# EAGLE design Pulleyboard (EAGLE 9.6.2)
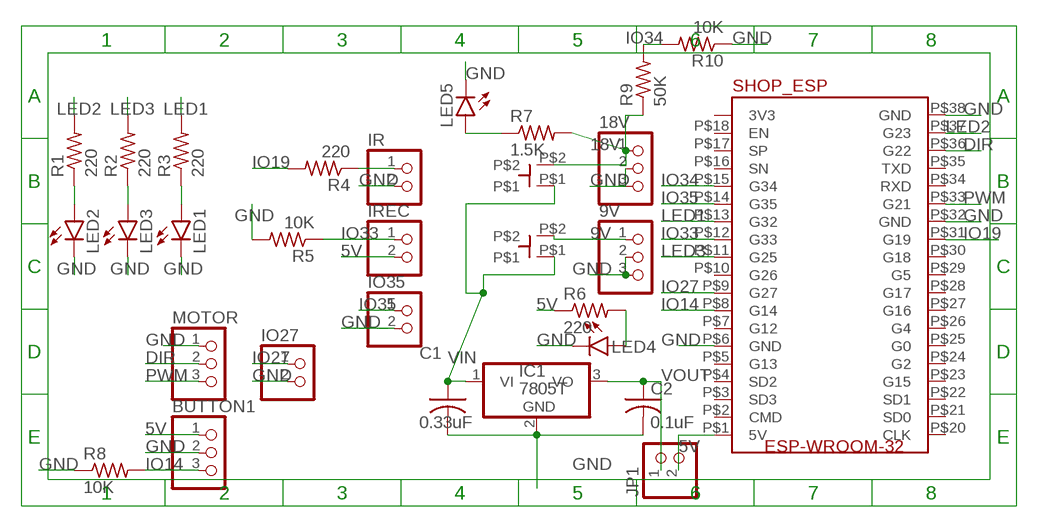
[diagram p0: schematic, sheet 1]

## Parts
9V  PINHD-1X3  [1X03]
9VSW  SWITCH  [SWTICH]
18V  PINHD-1X3  [1X03]
18VSW  SWITCH  [SWTICH]
BUTTON1  PINHD-1X3  [1X03]
C1  0.33uF  C-US025-030X050  [C025-030X050]
C2  0.1uF  C-US025-030X050  [C025-030X050]
IC1  7805T  [TO220H]
IO27  PINHD-1X2  [1X02]
IO35  PINHD-1X2  [1X02]
IR  PINHD-1X2  [1X02]
IREC  PINHD-1X2  [1X02]
JP1  PINHD-1X2  [1X02]
LED1  LED5MM  [LED5MM]
LED2  LED5MM  [LED5MM]
LED3  LED5MM  [LED5MM]
LED4  LEDCHIPLED_1206  [CHIPLED_1206]
LED5  LED5MM  [LED5MM]
MOTOR  PINHD-1X3  [1X03]
R1  220  R-US_R0805  [R0805]
R2  220  R-US_R0805  [R0805]
R3  220  R-US_R0805  [R0805]
R4  220  R-US_R0805  [R0805]
R5  10K  R-US_R0805  [R0805]
R6  220  R-US_R0805  [R0805]
R7  1.5K  R-US_R0805  [R0805]
R8  10K  R-US_R0805  [R0805]
R9  50K  R-US_R0805  [R0805]
R10  10K  R-US_R0805  [R0805]
U$3  SHOP_ESP  [ESP32-WROOM-32]

## Nets
5V: BUTTON1.1 IREC.2 JP1.2 R6.1 U$3.P$1(5V)
9V: 9V.1 9VSW.P$2
18V: 18V.1 18VSW.P$2 R7.2 R9.1
DIR: MOTOR.2 U$3.P$36(G22)
GND: 9V.2 9V.3 18V.2 18V.3 BUTTON1.2 C1.2 C2.2 IC1.2(GND) IO27.2 IO35.2 IR.2 LED1.K(C) LED2.K(C) LED3.K(C) LED4.C LED5.K(C) MOTOR.1 R5.2 R8.1 R10.1 U$3.P$6(GND) U$3.P$32(GND) U$3.P$38(GND)
IO14: BUTTON1.3 R8.2 U$3.P$8(G14)
IO19: R4.2 U$3.P$31(G19)
IO27: IO27.1 U$3.P$9(G27)
IO33: IREC.1 R5.1 U$3.P$12(G33)
IO34: R9.2 R10.2 U$3.P$15(G34)
IO35: IO35.1 U$3.P$14(G35)
LED1: R3.2 U$3.P$13(G32)
LED2: R1.2 U$3.P$37(G23)
LED3: R2.2 U$3.P$11(G25)
N$1: LED2.A R1.1
N$2: LED3.A R2.1
N$3: LED1.A R3.1
N$4: LED5.A R7.1
N$7: IR.1 R4.1
N$9: LED4.A R6.2
PWM: MOTOR.3 U$3.P$33(G21)
VIN: 9VSW.P$1 18VSW.P$1 C1.1 IC1.1(VI)
VOUT: C2.1 IC1.3(VO) JP1.1
Unconnected: U$3.P$3(SD3) U$3.P$4(SD2) U$3.P$5(G13) U$3.P$7(G12) U$3.P$10(G26) U$3.P$16(SN) U$3.P$17(SP) U$3.P$18(EN) U$3.P$20(CLK) U$3.P$21(SD0) U$3.P$22(SD1) U$3.P$23(G15) U$3.P$24(G2) U$3.P$25(G0) U$3.P$26(G4) U$3.P$27(G16) U$3.P$28(G17) U$3.P$29(G5) U$3.P$30(G18) U$3.P$34(RXD) U$3.P$35(TXD)

## Power pins joined to a net without a drawn wire
3V3: U$3.P$19(3V3)
CMD: U$3.P$2(CMD)

## Library data of the parts
9V 18V BUTTON1 MOTOR = pinhead:PINHD-1X3: PIN HEADER
9VSW = pulley:SWITCH; SPICEPREFIX: B
18VSW = pulley:SWITCH
C1 C2 = AAAMYrcl:C-US: CAPACITOR, American symbol; SPICEPREFIX: C
IC1 = linear:78*: Positive VOLTAGE REGULATOR Source: http://cache.national.com/ds/LM/LM78L05.pdf http://www.fairchildsemi.com/ds/LM/LM7805.pdf
IO27 IO35 IR IREC JP1 = pinhead:PINHD-1X2: PIN HEADER
LED1-LED3 LED5 = ledbighole:LED: LED OSRAM: - CHIPLED LG R971, LG N971, LY N971, LG Q971, LY Q971, LO R971, LY R971 LH N974, LH R974 LS Q976, LO Q976, LY Q976 LO Q996 - Hyper CHIPLED LW Q18S LB Q993, LB Q99A, LB R99A - SideLED LS A670, LO A670, LY A670, LG A670, LP A670 LB A673, LV A673, LT A673, LW A673 LH A674 LY A675 LS A676, LA A676, LO A676, LY A676, LW A676 LS A679, LY A679, LG A679 - Hyper Micro SIDELED® LS Y876, LA Y876, LO Y876, LY Y876 LT Y87S - SmartLED LW L88C, LW L88S LB L89C, LB L89S, LG L890 LS L89K, LO L89K, LY L89K LS L896, LA L896, LO L896, LY L896 - TOPLED LS T670, LO T670, LY T670, LG T670, LP T670 LSG T670, LSP T670, LSY T670, LOP T670, LYG T670 LG T671, LOG T671, LSG T671 LB T673, LV T673, LT T673, LW T673 LH T674 LS T676, LA T676, LO T676, LY T676, LB T676, LH T676, LSB T676, LW T676 LB T67C, LV T67C, LT T67C, LS T67K, LO T67K, LY T67K, LW E67C LS E67B, LA E67B, LO E67B, LY E67B, LB E67C, LV E67C, LT E67C LW T67C LS T679, LY T679, LG T679 LS T770, LO T770, LY T770, LG T770, LP T770 LB T773, LV T773, LT T773, LW T773 LH T774 LS E675, LA E675, LY E675, LS T675 LS T776, LA T776, LO T776, LY T776, LB T776 LHGB T686 LT T68C, LB T68C - Hyper Mini TOPLED® LB M676 - Mini TOPLED Santana® LG M470 LS M47K, LO M47K, LY M47K Source: http://www.osram.convergy.de LUXEON: - LUMILED® LXK2-PW12-R00, LXK2-PW12-S00, LXK2-PW14-U00, LXK2-PW14-V00 LXK2-PM12-R00, LXK2-PM12-S00, LXK2-PM14-U00 LXK2-PE12-Q00, LXK2-PE12-R00, LXK2-PE12-S00, LXK2-PE14-T00, LXK2-PE14-U00 LXK2-PB12-K00, LXK2-PB12-L00, LXK2-PB12-M00, LXK2-PB14-N00, LXK2-PB14-P00, LXK2-PB14-Q00 LXK2-PR12-L00, LXK2-PR12-M00, LXK2-PR14-Q00, LXK2-PR14-R00 LXK2-PD12-Q00, LXK2-PD12-R00, LXK2-PD12-S00 LXK2-PH12-R00, LXK2-PH12-S00 LXK2-PL12-P00, LXK2-PL12-Q00, LXK2-PL12-R00 Source: www.luxeon.com KINGBRIGHT: KA-3528ASYC Source: www.kingbright.com
LED4 = led:LED: LED OSRAM: - CHIPLED LG R971, LG N971, LY N971, LG Q971, LY Q971, LO R971, LY R971 LH N974, LH R974 LS Q976, LO Q976, LY Q976 LO Q996 - Hyper CHIPLED LW Q18S LB Q993, LB Q99A, LB R99A - SideLED LS A670, LO A670, LY A670, LG A670, LP A670 LB A673, LV A673, LT A673, LW A673 LH A674 LY A675 LS A676, LA A676, LO A676, LY A676, LW A676 LS A679, LY A679, LG A679 - Hyper Micro SIDELED® LS Y876, LA Y876, LO Y876, LY Y876 LT Y87S - SmartLED LW L88C, LW L88S LB L89C, LB L89S, LG L890 LS L89K, LO L89K, LY L89K LS L896, LA L896, LO L896, LY L896 - TOPLED LS T670, LO T670, LY T670, LG T670, LP T670 LSG T670, LSP T670, LSY T670, LOP T670, LYG T670 LG T671, LOG T671, LSG T671 LB T673, LV T673, LT T673, LW T673 LH T674 LS T676, LA T676, LO T676, LY T676, LB T676, LH T676, LSB T676, LW T676 LB T67C, LV T67C, LT T67C, LS T67K, LO T67K, LY T67K, LW E67C LS E67B, LA E67B, LO E67B, LY E67B, LB E67C, LV E67C, LT E67C LW T67C LS T679, LY T679, LG T679 LS T770, LO T770, LY T770, LG T770, LP T770 LB T773, LV T773, LT T773, LW T773 LH T774 LS E675, LA E675, LY E675, LS T675 LS T776, LA T776, LO T776, LY T776, LB T776 LHGB T686 LT T68C, LB T68C - Hyper Mini TOPLED® LB M676 - Mini TOPLED Santana® LG M470 LS M47K, LO M47K, LY M47K Source: http://www.osram.convergy.de LUXEON: - LUMILED® LXK2-PW12-R00, LXK2-PW12-S00, LXK2-PW14-U00, LXK2-PW14-V00 LXK2-PM12-R00, LXK2-PM12-S00, LXK2-PM14-U00 LXK2-PE12-Q00, LXK2-PE12-R00, LXK2-PE12-S00, LXK2-PE14-T00, LXK2-PE14-U00 LXK2-PB12-K00, LXK2-PB12-L00, LXK2-PB12-M00, LXK2-PB14-N00, LXK2-PB14-P00, LXK2-PB14-Q00 LXK2-PR12-L00, LXK2-PR12-M00, LXK2-PR14-Q00, LXK2-PR14-R00 LXK2-PD12-Q00, LXK2-PD12-R00, LXK2-PD12-S00 LXK2-PH12-R00, LXK2-PH12-S00 LXK2-PL12-P00, LXK2-PL12-Q00, LXK2-PL12-R00 Source: www.luxeon.com KINGBRIGHT: KA-3528ASYC Source: www.kingbright.com
R1-R10 = rcl:R-US_: RESISTOR, American symbol; SPICEPREFIX: R
U$3 = AAALib:SHOP_ESP

## Board
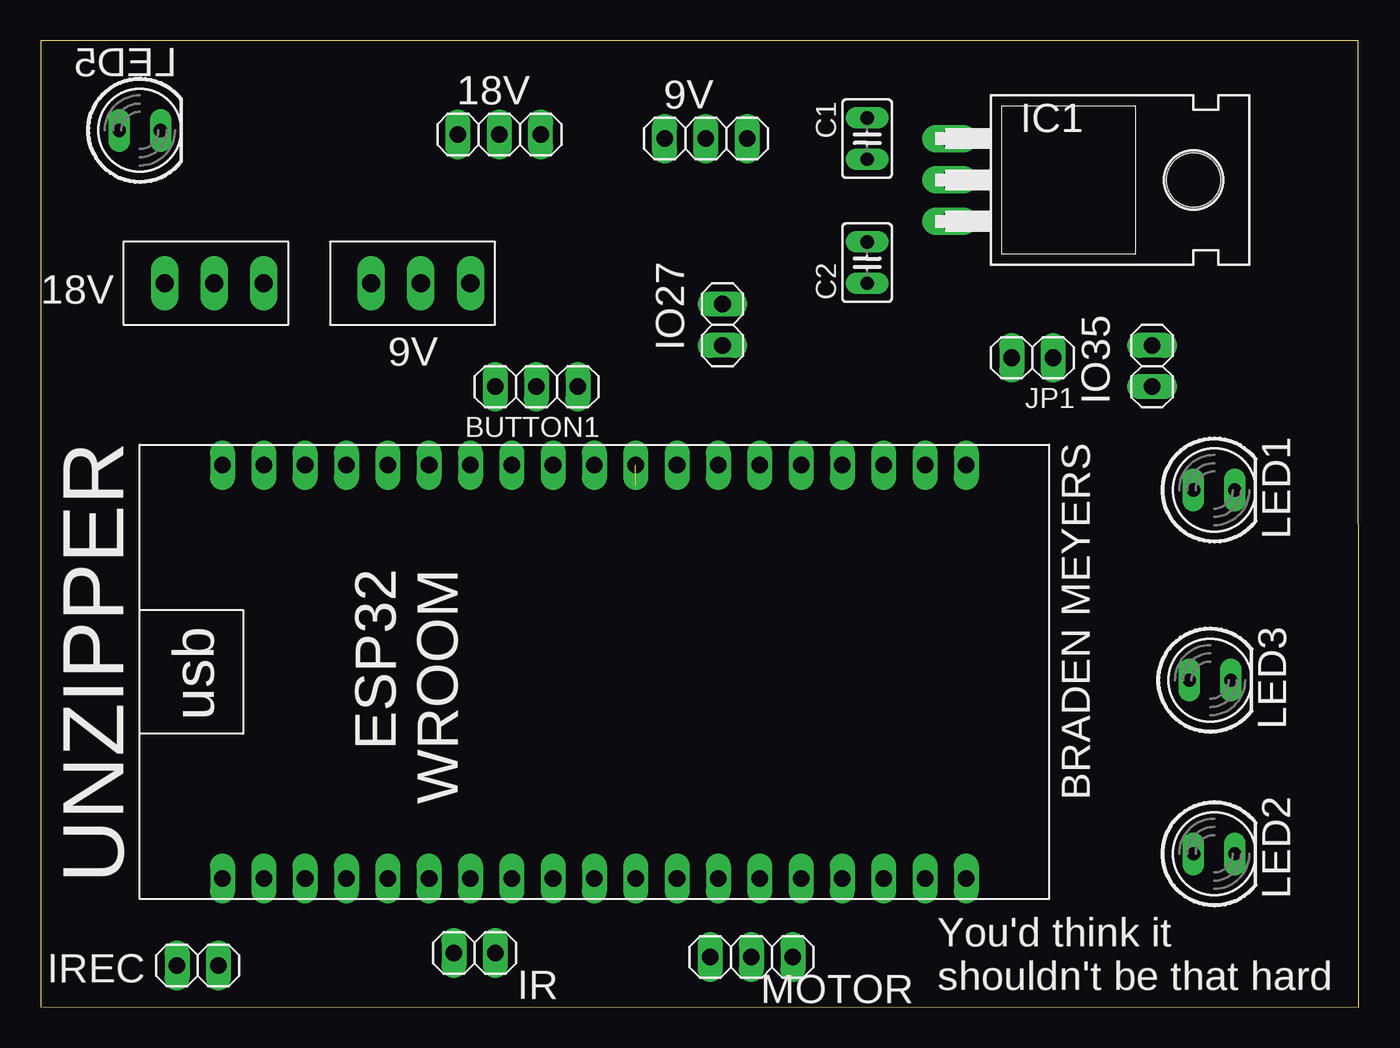
[diagram p1: board, top side]
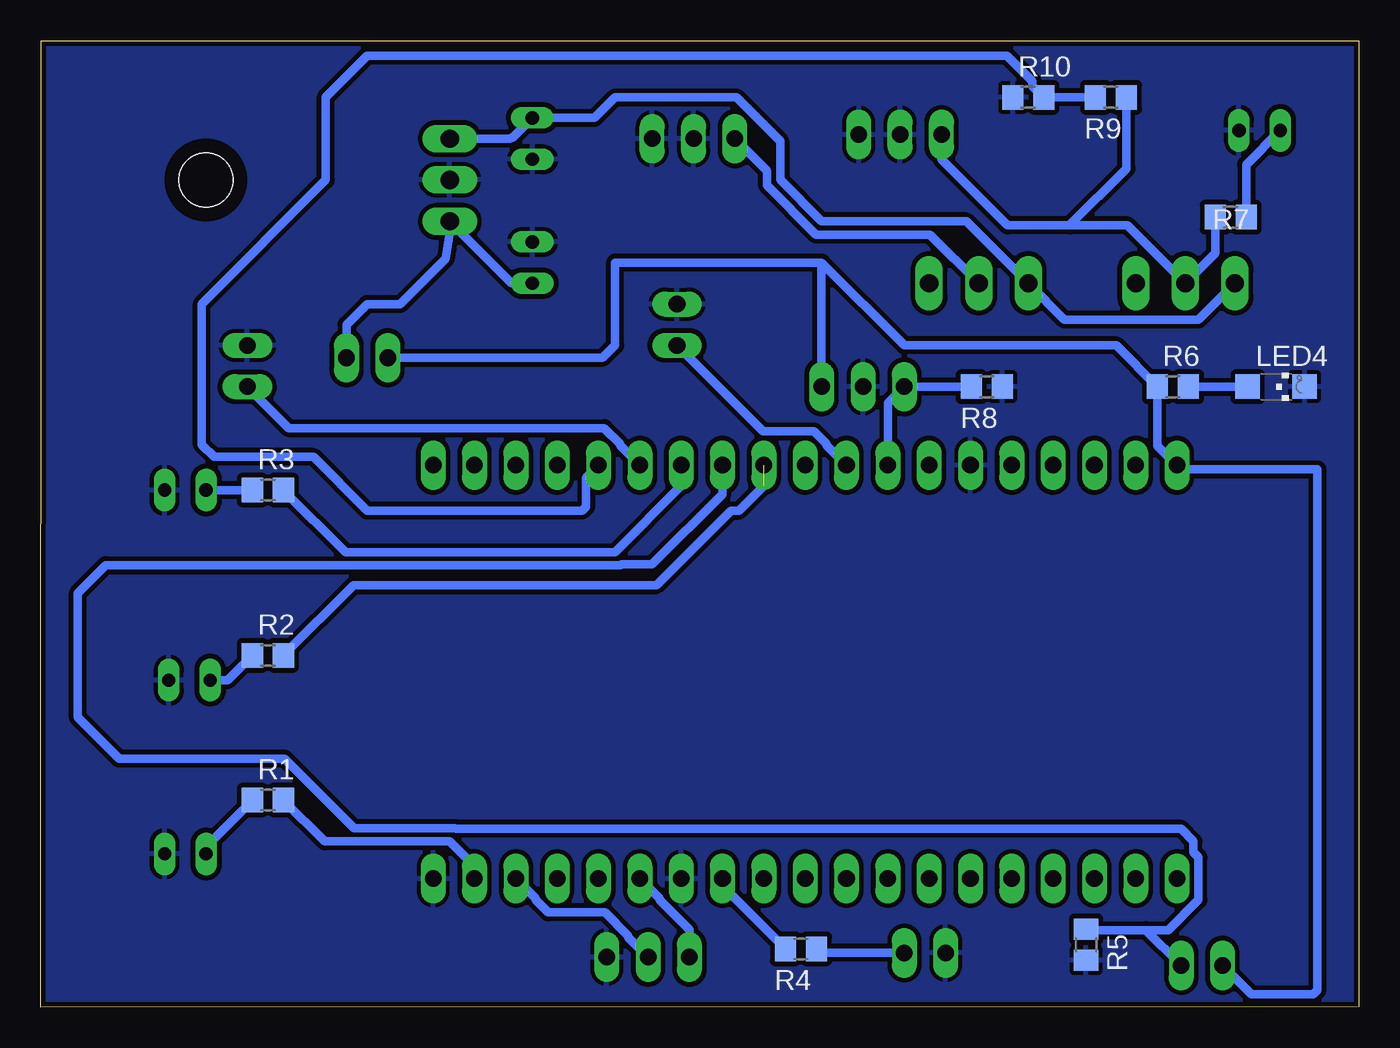
[diagram p2: board, bottom side, seen from below]

Size 81.03 x 59.38 mm. Coordinates in mm from the lower left corner, seen from the top.
Outline: 0,0.02 81.03,0 81.01,59.38 0,59.38 0,0.02
Copper layers (1*16): Top 0.035mm / dielectric 1.5mm / Bottom 0.035mm
Design rules "elcdrc *": minimum track width 20mil, minimum drill 0.3mm, track to track 12mil, track to pad 12mil, pad to pad 12mil, via to via 12mil, smd to smd 6mil, copper to edge 12mil, drill to drill 12mil, minimum pad ring 10mil, minimum via ring 8mil, stop-mask expansion 4mil, vias tented up to drill 0mil, thermal gap 10mil

### Footprints (pad centres in the part's own frame; a part is rotated, then mirrored left to right if it is on the bottom)
1X03 = drill 1.016 long: 1 -2.54,0; 2 0,0; 3 2.54,0
SWTICH = drill 1.118 pad 1.676 long: P$1 0,0; P$2 3.048,0; P$3 6.096,0
C025-030X050 = drill 0.813 long: 1 -1.27,0; 2 1.27,0
TO220H = drill 1.118 long: 1 -2.54,-10.16; 2 0,-10.16; 3 2.54,-10.16 | hole 3.302: 0,4.826
1X02 = drill 1.016 long: 1 -1.27,0; 2 1.27,0
LED5MM = drill 0.813 long: A -1.27,0; K 1.27,0
CHIPLED_1206 = smd 1.5 x 1.5: A 0,-1.75; C 0,1.75
R0805 = smd 1.3 x 1.5: 1 -0.95,0; 2 0.95,0
ESP32-WROOM-32 = drill 1.016 long: P$1 1.27,5.08; P$2 1.27,7.62; P$3 1.27,10.16; P$4 1.27,12.7; P$5 1.27,15.24; P$6 1.27,17.78; P$7 1.27,20.32; P$8 1.27,22.86; P$9 1.27,25.4; P$10 1.27,27.94; P$11 1.27,30.48; P$12 1.27,33.02; P$13 1.27,35.56; P$14 1.27,38.1; P$15 1.27,40.64; P$16 1.27,43.18; P$17 1.27,45.72; P$18 1.27,48.26; P$19 1.27,50.8; P$20 26.67,5.08; P$21 26.67,7.62; P$22 26.67,10.16; P$23 26.67,12.7; P$24 26.67,15.24; P$25 26.67,17.78; P$26 26.67,20.32; P$27 26.67,22.86; P$28 26.67,25.4; P$29 26.67,27.94; P$30 26.67,30.48; P$31 26.67,33.02; P$32 26.67,35.56; P$33 26.67,38.1; P$34 26.67,40.64; P$35 26.67,43.18; P$36 26.67,45.72; P$37 26.67,48.26; P$38 26.67,50.8

### Placement (x,y rotation side)
9V  40.89,53.36 0 top
9VSW  20.32,44.47 0 top
18V  28.19,53.61 0 top
18VSW  7.62,44.47 0 top
BUTTON1  30.48,38.12 180 top
C1  50.8,53.36 270 top
C2  50.8,45.74 90 top
IC1  66.04,50.82 270 top
IO27  41.91,41.93 90 top
IO35  68.33,39.39 90 top
IR  26.67,3.32 180 top
IREC  9.65,2.56 180 top
JP1  60.96,39.9 180 top
LED1  72.14,31.77 0 top
LED2  72.14,9.42 0 top
LED3  71.88,20.09 0 top
LED4  5.08,38.12 270 bottom
LED5  6.1,53.87 0 top
MOTOR  43.69,3.07 180 top
R1  67.06,12.72 0 bottom
R2  67.06,21.61 0 bottom
R3  67.06,31.77 0 bottom
R4  34.29,3.58 180 bottom
R5  16.76,3.83 270 bottom
R6  11.43,38.12 0 bottom
R7  7.87,48.53 180 bottom
R8  22.86,38.12 180 bottom
R9  15.24,55.9 180 bottom
R10  20.32,55.9 0 bottom
U$3  6.1,34.56 270 top

### Tracks (layer width: path | path; a pad name or v marks a point on that pad's centre or on a via)
5V
  Bottom 0.508: IREC.2 6.6,0.78 2.79,0.78 2.54,1.04 2.54,33.04 10.92,33.04 U$3.P$1 12.38,34.5 R6.1 14.92,40.66 27.94,40.66 33.02,45.74 | 33.02,45.74 45.72,45.74 45.72,40.66 46.48,39.9 JP1.2 | BUTTON1.1 33.02,45.74
9V
  Bottom 0.508: 9VSW.P$2 26.36,47.47 33.36,47.47 36.37,50.48 36.37,51.38 9V.1
18V
  Bottom 0.508: R7.2 8.82,46.31 18VSW.P$2 14.22,48.03 17.78,48.03 | 17.78,48.03 21.59,48.03 25.65,52.09 18V.1 | 17.78,48.03 14.29,51.52 R9.1
DIR
  Bottom 0.508: MOTOR.2 44.91,4.29 44.91,4.38 46.34,5.81 49.82,5.81 50.6,6.58 50.6,6.67 U$3.P$36
GND
  pour Bottom: 0,-2.52 81.28,-2.52 81.28,60.98 -2.54,60.98 -2.54,58.44 -2.54,-2.52
IO14
  Bottom 0.508: U$3.P$8 28.96,37.1 BUTTON1.3 R8.2
IO19
  Bottom 0.508: R4.2 39.12,7.45 U$3.P$31
IO27
  Bottom 0.508: IO27.1 36.63,35.38 33.49,35.38 32.72,34.6 32.72,34.51 U$3.P$9
IO33
  Bottom 0.508: IREC.1 13.08,4.72 | R5.1 16.76,4.72 13.08,4.72 | 13.08,4.72 11.72,4.72 9.86,6.58 9.86,9.2 10.16,9.51 10.16,10.18 10.92,10.94 55.49,10.94 55.54,10.99 61.77,10.99 66.04,15.26 76.2,15.26 78.74,17.8 78.74,25.42 77.01,27.15 45.38,27.15 45.33,27.2 43.43,27.2 39.12,31.52 U$3.P$12
IO34
  Bottom 0.508: R9.2 R10.2 20.06,56.59 20.06,56.88 21.62,58.44 60.96,58.44 63.5,55.9 63.5,50.82 71.12,43.2 71.12,34.56 70.36,33.8 64.26,33.8 60.96,30.5 47.75,30.5 47.5,30.75 47.5,32.53 U$3.P$15
IO35
  Bottom 0.508: IO35.1 65.79,35.58 46.39,35.58 45.41,34.6 45.41,34.51 U$3.P$14
LED1
  Bottom 0.508: R3.2 62.3,27.96 45.72,27.96 41.66,32.02 U$3.P$13
LED2
  Bottom 0.508: U$3.P$37 54.36,8.66 55.88,10.18 63.57,10.18 R1.2
LED3  (1 unrouted)
  Bottom 0.508: R2.2 61.79,25.93 43.18,25.93 38.61,30.5 38.1,30.5 36.58,32.02
N$1
  Bottom 0.508: LED2.A 70.87,9.86 R1.1
N$2
  Bottom 0.508: LED3.A 69.53,20.09 R2.1
N$3
  Bottom 0.508: R3.1 LED1.A
N$4
  Bottom 0.508: LED5.A 6.92,51.77 R7.1
N$7
  Bottom 0.508: IR.1 33.09,3.32 R4.1
N$9
  Bottom 0.508: R6.2 LED4.A
PWM
  Bottom 0.508: U$3.P$33 42.98,6.67 42.98,6.58 41.15,4.76 MOTOR.3
VIN
  Bottom 0.508: 18VSW.P$1 9.86,42.24 18.09,42.24 9VSW.P$1 24.13,48.28 33.02,48.28 35.56,50.82 35.56,53.2 38.26,55.9 45.72,55.9 46.99,54.63 C1.1 52.02,53.41 52.11,53.41 52.16,53.36 IC1.1
VOUT
  Bottom 0.508: C2.1 52.07,44.47 IC1.3 55.88,47.52 56.13,45.99 58.93,43.2 60.96,43.2 62.23,41.93 JP1.1

### Text on the board
tNames: 18V | 9V | BRADEN MEYERS | UNZIPPER | You'd think it / shouldn't be that hard